# Altium schematic sheet Audio.SchDoc
size 420 x 297 mm; SheetNumber: 9; SheetTotal: 16
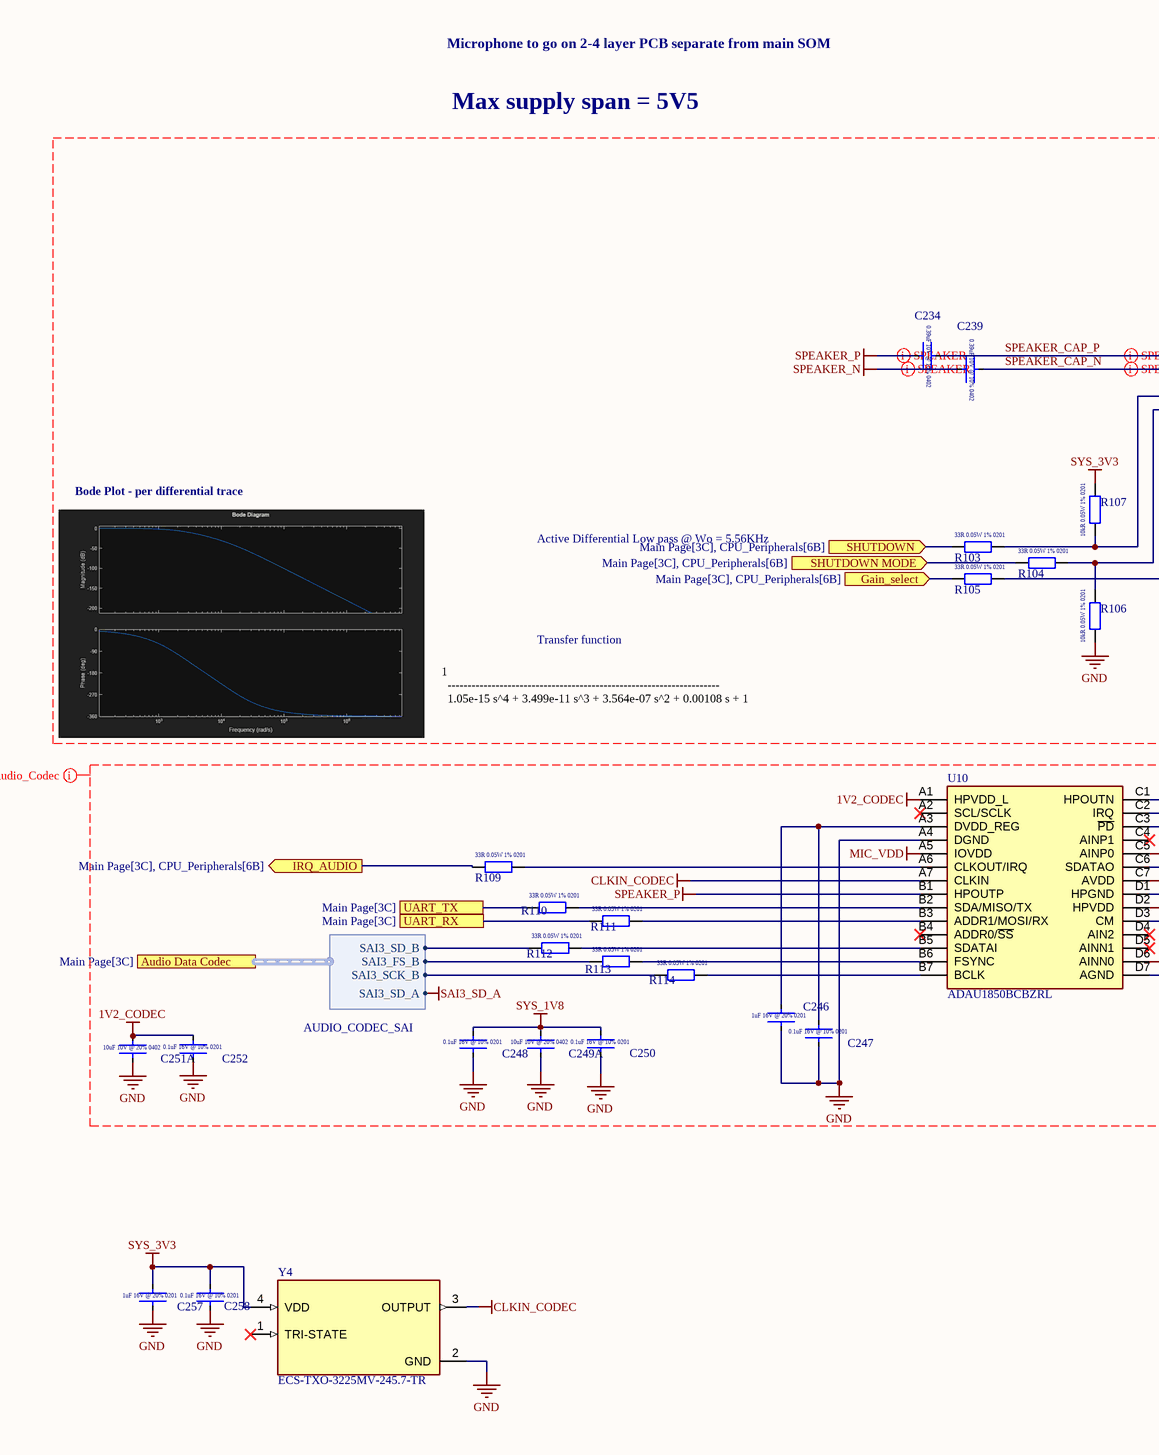
[diagram p0: Audio.SchDoc, left]
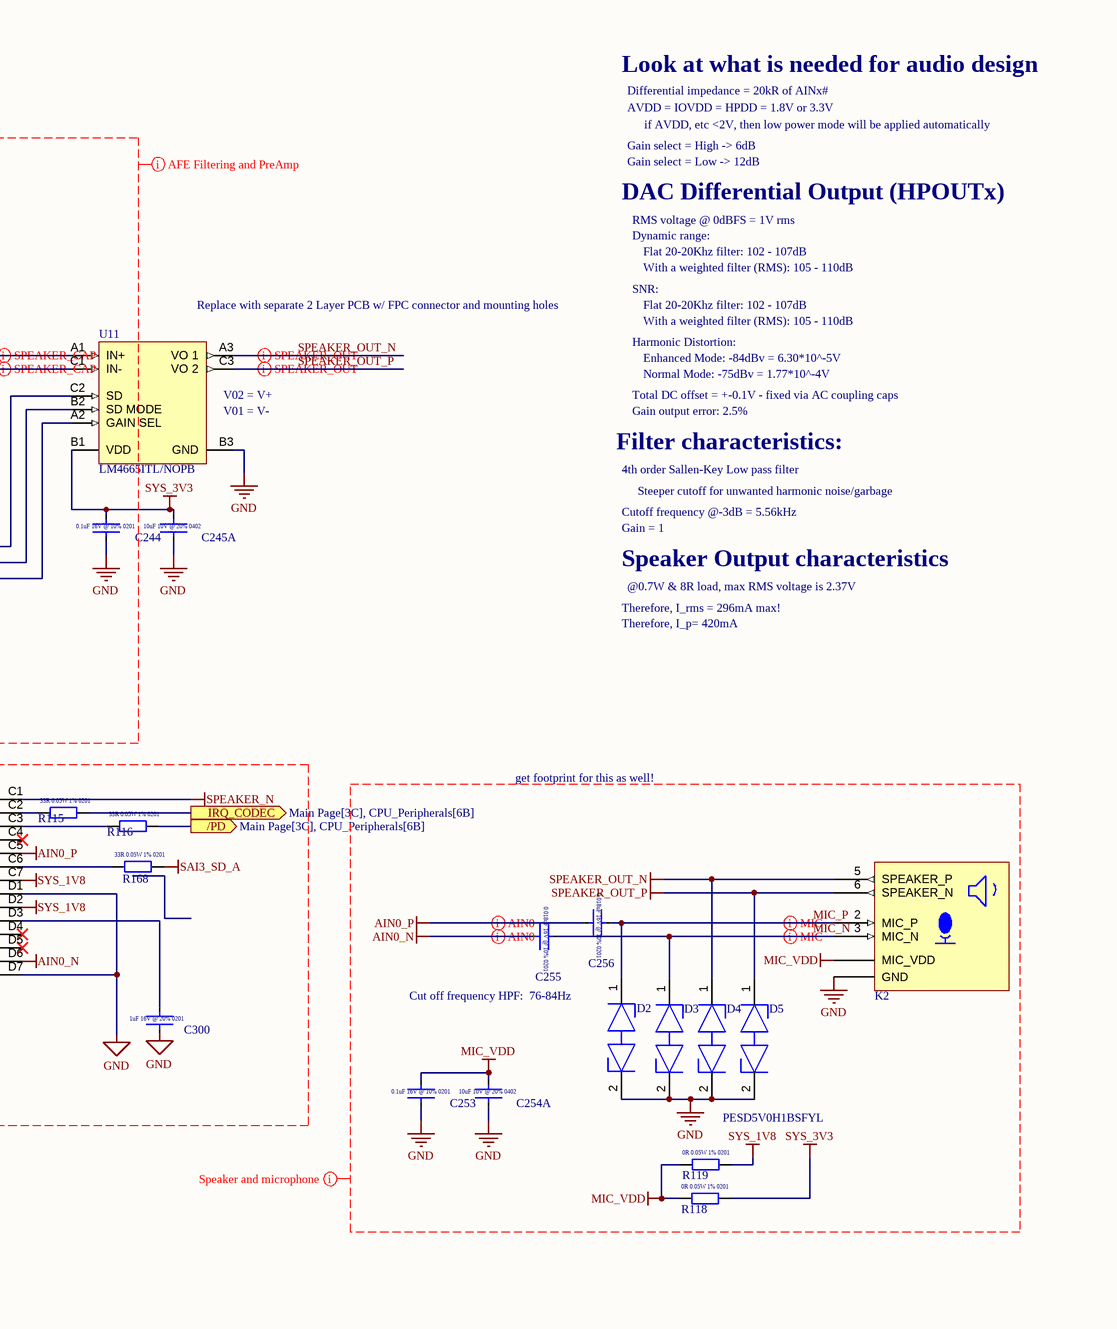
[diagram p1: Audio.SchDoc, right]

## Parts
C234  CC0402KRX5R6BB394  [CAPC1005X06L]  (value not drawn)
C239  CC0402KRX5R6BB394  [CAPC1005X06L]  (value not drawn)
C244  0.1uF  [CAPC0603X03L]  (value not drawn)
C245  GRT155R61A106ME13J  [CAPC1005X06L]  (value not drawn)  (part A of 2)
C246  GRM033R61C105ME15D  [CAPC0603X03L]  (value not drawn)
C247  0.1uF  [CAPC0603X03L]  (value not drawn)
C248  0.1uF  [CAPC0603X03L]  (value not drawn)
C249  GRT155R61A106ME13J  [CAPC1005X06L]  (value not drawn)  (part A of 2)
C250  0.1uF  [CAPC0603X03L]  (value not drawn)
C251  GRT155R61A106ME13J  [CAPC1005X06L]  (value not drawn)  (part A of 2)
C252  0.1uF  [CAPC0603X03L]  (value not drawn)
C253  0.1uF  [CAPC0603X03L]  (value not drawn)
C254  GRT155R61A106ME13J  [CAPC1005X06L]  (value not drawn)  (part A of 2)
C255  GRM033R61C183KE84D  [CAPC0603X03L]  (value not drawn)
C256  GRM033R61C183KE84D  [CAPC0603X03L]  (value not drawn)
C257  GRM033R61C105ME15D  [CAPC0603X03L]  (value not drawn)
C258  0.1uF  [CAPC0603X03L]  (value not drawn)
C300  GRM033R61C105ME15D  [CAPC0603X03L]  (value not drawn)
D2  PESD5V0H1BSFYL  [FP-SOD962-2-MFG]  (value not drawn)
D3  PESD5V0H1BSFYL  [FP-SOD962-2-MFG]  (value not drawn)
D4  PESD5V0H1BSFYL  [FP-SOD962-2-MFG]
D5  PESD5V0H1BSFYL  [FP-SOD962-2-MFG]  (value not drawn)
K2  DF40C-10DS-0.4V(51)  [DF40C-10DS-0.4V(51)]  (value not drawn)
R103  ERJ-1GNF33R0C  [RESC0603X03L]  (value not drawn)
R104  ERJ-1GNF33R0C  [RESC0603X03L]  (value not drawn)
R105  ERJ-1GNF33R0C  [RESC0603X03L]  (value not drawn)
R106  ERJ-1GNF1002C  [RESC0603X03L]  (value not drawn)
R107  ERJ-1GNF1002C  [RESC0603X03L]  (value not drawn)
R109  ERJ-1GNF33R0C  [RESC0603X03L]  (value not drawn)
R110  ERJ-1GNF33R0C  [RESC0603X03L]  (value not drawn)
R111  ERJ-1GNF33R0C  [RESC0603X03L]  (value not drawn)
R112  ERJ-1GNF33R0C  [RESC0603X03L]  (value not drawn)
R113  ERJ-1GNF33R0C  [RESC0603X03L]  (value not drawn)
R114  ERJ-1GNF33R0C  [RESC0603X03L]  (value not drawn)
R115  ERJ-1GNF33R0C  [RESC0603X03L]  (value not drawn)
R116  ERJ-1GNF33R0C  [RESC0603X03L]  (value not drawn)
R118  ERJ-1GN0R00C  [RESC0603X03L]  (value not drawn)
R119  ERJ-1GN0R00C  [RESC0603X03L]  (value not drawn)
R168  ERJ-1GNF33R0C  [RESC0603X03L]  (value not drawn)
U10  ADAU1850BCBZRL  [BGA28C40P7X4_296X176X57]
U11  LM4665ITL/NOPB  [YZR0009ADAD]
Y4  ECS-TXO-3225MV-245.7-TR  [OSC_ECS-TXO-3225MV-245.7-TR]

## Ports
/PD (out, see Main Page[3C], CPU_Peripherals[6B]), Audio Data Codec (harness AUDIO_CODEC_SAI, see Main Page[3C]), Gain_select (in, see Main Page[3C], CPU_Peripherals[6B]), IRQ_AUDIO (out, see Main Page[3C], CPU_Peripherals[6B]), IRQ_CODEC (out, see Main Page[3C], CPU_Peripherals[6B]), SHUTDOWN (in, see Main Page[3C], CPU_Peripherals[6B]), SHUTDOWN MODE (in, see Main Page[3C], CPU_Peripherals[6B]), UART_RX (see Main Page[3C]), UART_TX (see Main Page[3C])

## Harnesses
AUDIO_CODEC_SAI: SAI3_FS_B, SAI3_SCK_B, SAI3_SD_B, SAI3_SD_A

## Nets
1V2_CODEC: C251.2 C252.2 U10.A1(HPVDD_L)
AIN0_N: C255.1 U10.D6(AINN0)
AIN0_P: C256.1 U10.C5(AINP0)
CLKIN_CODEC: U10.A7(CLKIN) Y4.3(OUTPUT)
GND: C244.1 C245.1 C246.1 C247.1 C248.1 C249.1 C250.1 C251.1 C252.1 C253.1 C254.1 C257.1 C258.1 C300.1 D2.2(K2) D3.2(K2) D4.2(K2) D5.2(K2) K2.1,4,7,8,9,10,11,14(GND) R106.1 U10.A4(DGND) U10.D1(HPGND) U10.D7(AGND) U11.B3(GND) Y4.2(GND)
MIC_VDD: C253.2 C254.2 K2.12,13(MIC_VDD) R118.1 R119.1 U10.A5(IOVDD)
SAI3_SD_A: R168.2 ; port Audio Data Codec.SAI3_SD_A
SPEAKER_N: C239.1 U10.C1(HPOUTN)
SPEAKER_OUT_N: D4.1(K1) K2.5(SPEAKER_P) U11.A3(VO_1)
SPEAKER_OUT_P: D5.1(K1) K2.6(SPEAKER_N) U11.C3(VO_2)
SPEAKER_P: C234.1 U10.B1(HPOUTP)
SYS_1V8: C248.2 C249.2 C250.2 R119.2 U10.C7(AVDD) U10.D2(HPVDD)
SYS_3V3: C244.2 C245.2 C257.2 C258.2 R107.2 R118.2 U11.B1(VDD) Y4.4(VDD)
/PD: R116.2 ; port /PD
Gain_select: R105.1 ; port Gain_select
IRQ_AUDIO: R109.1 ; port IRQ_AUDIO
IRQ_CODEC: R115.2 ; port IRQ_CODEC
MIC_N: C255.2 D3.1(K1) K2.3(MIC_N)
MIC_P: C256.2 D2.1(K1) K2.2(MIC_P)
SHUTDOWN: R103.1 ; port SHUTDOWN
SHUTDOWN MODE: R104.1 ; port SHUTDOWN MODE
SPEAKER_CAP_N: C239.2 U11.C1(IN-)
SPEAKER_CAP_P: C234.2 U11.A1(IN+)
UART_RX: R111.1 ; port UART_RX
UART_TX: R110.1 ; port UART_TX
NetC246_2: C246.2 C247.2 U10.A3(DVDD_REG)
NetC300_2: C300.2 U10.D3(CM)
NetR103_2: R103.2 R107.1 U11.C2(SD)
NetR104_2: R104.2 R106.2 U11.B2(SD_MODE)
NetR105_2: R105.2 U11.A2(GAIN_SEL)
NetR109_2: R109.2 U10.A6(CLKOUT/IRQ)
NetR110_2: R110.2 U10.B2(SDA/MISO/TX)
NetR111_2: R111.2 U10.B3(ADDR1/MOSI/RX)
NetR112_1: R112.1 ; port Audio Data Codec.SAI3_SD_B
NetR112_2: R112.2 U10.B5(SDATAI)
NetR113_1: R113.1 ; port Audio Data Codec.SAI3_FS_B
NetR113_2: R113.2 U10.B6(FSYNC)
NetR114_1: R114.1 ; port Audio Data Codec.SAI3_SCK_B
NetR114_2: R114.2 U10.B7(BCLK)
NetR115_1: R115.1 U10.C2(IRQ)
NetR116_1: R116.1 U10.C3(~{PD})
NetR168_1: R168.1 U10.C6(SDATAO)

Not connected (* = marked no-connect by the designer): U10 A2(SCL/SCLK)* B4(ADDR0/~{SS})* C4(AINP1)* D4(AIN2)* D5(AINN1)*; Y4 1(TRI-STATE)*

## Layout directives
mark named Audio FPC: (no net found under the mark)
differential pair: MIC_N, MIC_P, SPEAKER_CAP_N, SPEAKER_CAP_P, SPEAKER_N, SPEAKER_OUT_N, SPEAKER_OUT_P, SPEAKER_P
differential pair; net class *: AIN0_N, AIN0_P
net class Audio Codec: 1V2_CODEC, AIN0_N, AIN0_P, CLKIN_CODEC, GND, MIC_VDD, SAI3_SD_A, SPEAKER_N, SPEAKER_P, SYS_1V8
net class Speaker and microphone: AIN0_N, AIN0_P, GND, MIC_N, MIC_P, MIC_VDD, SPEAKER_OUT_N, SPEAKER_OUT_P, SYS_1V8, SYS_3V3
net class AFE Filtering and PreAmp: GND, SPEAKER_CAP_N, SPEAKER_CAP_P, SPEAKER_N, SPEAKER_P, SYS_3V3

## Notes on the sheet
- Microphone to go on 2-4 layer PCB separate from main SOM
- Look at what is needed for audio design
- Max supply span = 5V5
- Gain select = High -> 6dB
- Differential impedance = 20kR of AINx#
- AVDD = IOVDD = HPDD = 1.8V or 3.3V
- if AVDD, etc <2V, then low power mode will be applied automatically
- DAC Differential Output (HPOUTx)
- Gain select = Low -> 12dB
- RMS voltage @ 0dBFS = 1V rms
- Dynamic range:
- Flat 20-20Khz filter: 102 - 107dB
- With a weighted filter (RMS): 105 - 110dB
- (near U11) Replace with separate 2 Layer PCB w/ FPC connector and mounting holes
- SNR:
- Harmonic Distortion:
- (near U11) V02 = V+
- (near U11) V01 = V-
- Total DC offset = +-0.1V - fixed via AC coupling caps
- Gain output error: 2.5%
- Enhanced Mode: -84dBv = 6.30*10^-5V
- Normal Mode: -75dBv = 1.77*10^-4V
- Filter characteristics:
- 4th order Sallen-Key Low pass filter
- Bode Plot - per differential trace
- Active Differential Low pass @ Wo = 5.56KHz
- Cutoff frequency @-3dB = 5.56kHz
- Gain = 1
- Steeper cutoff for unwanted harmonic noise/garbage
- Speaker Output characteristics
- Therefore, I_rms = 296mA max!
- @0.7W & 8R load, max RMS voltage is 2.37V
- Transfer function
- Therefore, I_p= 420mA
- 1
  --------------------------------------------------------------------
  1.05e-15 s^4 + 3.499e-11 s^3 + 3.564e-07 s^2 + 0.00108 s + 1
- get footprint for this as well!
- (near D2) Cut off frequency HPF:  76-84Hz
- THIS DOCUMENT AND THE DATA DISCLOSED HEREIN OR
- HEREWITH IS THE PROPERTY OF ALTIUM LIMITED AND MAY
- DWG NO:
- REVISION
- REV:
- DESCRIPTION
- DATE
- APPROVED
- BE FREELY DISTRIBUTED IN WHOLE. NO RIGHTS ARE
- RESERVED OR EXPRESS OR IMPLIED WARANTEE GIVEN.
- ENG:
- APPROVALS
- PROJECT
- DSN:
- CHK:
- REFERENCE DOCUMENTS
- PROJECT REVISION:
- TITLE
- DOCUMENT REVISION:
- DESIGN ITEM:
- BOM:
- FAB DWG:
- PCB DWG:
- ASSY DWG:
- SCALE:
- A3
- SIZE
- CAGE CODE
- FILE NAME
- DWG NO.
- SHEET
- OF
- REV
- (in symbol CC0402KRX5R6BB394) 0.39uF 10V @ 10% 0402
- (in symbol ERJ-1GN0R00C) 0R 0.05W 1% 0201
- (in symbol ERJ-1GNF33R0C) 33R 0.05W 1% 0201
- (in symbol ERJ-1GNF1002C) 10kR 0.05W 1% 0201
- (in symbol GRM033R61C105ME15D) 1uF 16V @ 20% 0201
- (in symbol GRM033R61C183KE84D) 0.018uF 16V @ 10% 0201
- (in symbol GRM033R61E104KE14J) 0.1uF 16V @ 10% 0201
- (in symbol GRT155R61A106ME13J, part A) 10uF 10V @ 20% 0402

## Library data of the parts
C234 C239 = CC0402KRX5R6BB394: 0.39 µF ±10% 10V Ceramic Capacitor X5R 0402 (1005 Metric); ComponentLink1Description: New link; ComponentLink1URL: https://www.digikey.com.au/en/products/detail/yageo/CC0402KRX5R6BB394/20376267
C244 C247 C248 C250 C252 C253 C258 = GRM033R61E104KE14J: 0.1 µF ±10% 25V Ceramic Capacitor X5R 0201 (0603 Metric)0.1 µF ±10% 25V Ceramic Capacitor X5R 0201 (0603 Metric); ComponentLink1Description: New link; ComponentLink1URL: https://www.digikey.com.au/en/products/detail/murata-electronics/GRM033R61E104KE14J/4904732?s=N4IgTCBcDaIOICUCyAGAzGhA2AjAURxQBYBpAogKRAF0BfIA
C245 C249 C251 C254 = GRT155R61A106ME13J: 10 µF ±20% 10V Ceramic Capacitor X5R 0402 (1005 Metric); ComponentLink1Description: New link; ComponentLink1URL: https://www.digikey.com.au/en/products/detail/murata-electronics/GRT155R61A106ME13J/19115510
C246 C257 C300 = GRM033R61C105ME15D: 1 µF ±20% 16V Ceramic Capacitor X5R 0201 (0603 Metric); ComponentLink1Description: New link; ComponentLink1URL: https://www.digikey.com.au/en/products/detail/murata-electronics/GRM033R61C105ME15D/10326307
C255 C256 = GRM033R61C183KE84D: 0.018 µF ±10% 16V Ceramic Capacitor X5R 0201 (0603 Metric); ComponentLink1Description: New link; ComponentLink1URL: https://www.digikey.com.au/en/products/detail/murata-electronics/GRM033R61C183KE84D/5027499
D2-D5 = CMP-14436-000004-1: TVS DIODE 5V 5V DSN0603-2; Manufacturer: Nexperia; Breakdown Voltage: 6V; Direction: Bidirectional; Value: 0.15pF; Clamping Voltage: 6.3V; Number Of Channels: 1; Peak Pulse Current: 7A; Max Junction Temp: +150°C; Lead Free: Yes; Reverse Standoff Voltage: 5V; Footprint Url: https://assets.nexperia.com/documents/outline-drawing/SOD962-2.pdf; ComponentLink2Description: Datasheet; Height: 0.32mm; Ambient Temperature Range Low: -40°C; Manufacturer Part Number: PESD5V0H1BSFYL; Octopart: https://octopart.com/pesd5v0h1bsfyl-nexperia-78741149; Ambient Temperature Range High: +125°C; RoHS: TRUE; Temperature: to +150°C; Capacitance: 0.15pF; ComponentLink2URL: https://assets.nexperia.com/documents/data-sheet/PESD5V0H1BSF.pdf; Temperature Range High: +150°C; Device Class L2: TVS Diodes; Digikey Description: TVS DIODE 5V 5V DSN0603-2; Category: Diode; Device Class L3: unset; Device Class L1: Circuit Protection; Package: SOD962-2; Automotive: No
K2 = DF40C-10DS-0.4V(51): 10 Position Connector Plug, Outer Shroud Contacts Surface Mount Gold; ComponentLink1Description: New link; ComponentLink1URL: https://www.digikey.com.au/en/products/detail/hirose-electric-co-ltd/DF40C-10DP-0-4V-51/1969496; Supplier 1: Digikey; Supplier Part Number 1: H11616CT-ND
R103-R105 R109-R116 R168 = ERJ-1GNF33R0C: 33 Ohms ±1% 0.05W, 1/20W Chip Resistor 0201 (0603 Metric) Thick Film; ComponentLink1Description: New link; ComponentLink1URL: https://www.digikey.com.au/en/products/detail/panasonic-electronic-components/ERJ-1GNF33R0C/2035941
R106 R107 = ERJ-1GNF1002C: 10 kOhms ±1% 0.05W, 1/20W Chip Resistor 0201 (0603 Metric) Thick Film; ComponentLink1Description: New link; ComponentLink1URL: https://www.digikey.com.au/en/products/detail/panasonic-electronic-components/ERJ-1GNF1002C/2036226
R118 R119 = ERJ-1GN0R00C: 0 Ohms Jumper Chip Resistor 0201 (0603 Metric) Thick Film; ComponentLink1Description: New link; ComponentLink1URL: https://www.digikey.com.au/en/products/detail/panasonic-electronic-components/ERJ-1GN0R00C/3982613
U10 = ADAU1850BCBZRL: Integrated Circuit; Manufacturer_Name: Analog Devices; Datasheet Link: https://www.analog.com/ADAU1850/datasheet?ADICID=SYND_WW_P682800_PF-spglobal; Height: 0.57mm; Manufacturer_Part_Number: ADAU1850BCBZRL
U11 = CMP-0057-00216-3: Filterless High Efficiency 1W Switching Audio Amplifier, 9-pin Micro SMD, Pb-Free; Manufacturer: Texas Instruments; CompType: Audio IC; PowerWise: N; High-Reliability: Y; PackageTopMarking: XVG*I A2; RoHS: Y; PackageReference: YZR0009ADAD; PartNumber: LM4665ITL/NOPB; PinCount: 9; Code_JEDEC: MO-211-DD; ComponentLink1URL: http://www.ti.com/general/docs/lit/getliterature.tsp?genericPartNumber=LM4665&fileType=pdf; PackageDescription: Thin Micro SMD, 9 Bump (Large), 0.5mm Pitch; ComponentLink1Description: Datasheet URL; ComponentLink2Description: New link; ComponentLink2URL: https://www.digikey.com.au/en/products/detail/texas-instruments/LM4665ITL-NOPB/947582?srsltid=AfmBOooQQxw4q3qhtfItGu5hSrTxqZeWwiOQWCJ-ImR-j4MOWvtk_TuD
Y4 = ECS-TXO-3225MV-245.7-TR: TCXO Oscillators 24.576 MHZ Multi-Volt +1.7 3.6V HCMOS TCXO +/-2.5 ppm -30 +85 C 3.2x 2.5mm RoHS; MF: ECS; SnapEDA_Link: https://www.snapeda.com/parts/ECS-TXO-3225MV-245.7-TR/ECS/view-part/?ref=snap; Package: ECS-TXO-3225MV-0-4 ECS; Value: *; MP: ECS-TXO-3225MV-245.7-TR; Check_prices: https://www.snapeda.com/parts/ECS-TXO-3225MV-245.7-TR/ECS/view-part/?ref=eda; ComponentLink1Description: New link; ComponentLink1URL: https://www.digikey.com.au/en/products/detail/ecs-inc/ECS-TXO-3225MV-245-7-TR/16578392?s=N4IgjCBcpgHAzFUBjKAzAhgGwM4FMAaEAeygG0QAWMABgDYAmOkAXSIAcAXKEAZU4BOASwB2AcxABfIgwDszaCFSRMuQiXIg6YeDRqsO3SH0GiJ08AE5YlpEvTZ8RUpAr6WFhmACs%2BxctUnDVcQBkoAOm95AAIAWQAJAC8DEC4eAFURIU4AeTRYvAwcAFcBPClJSSA